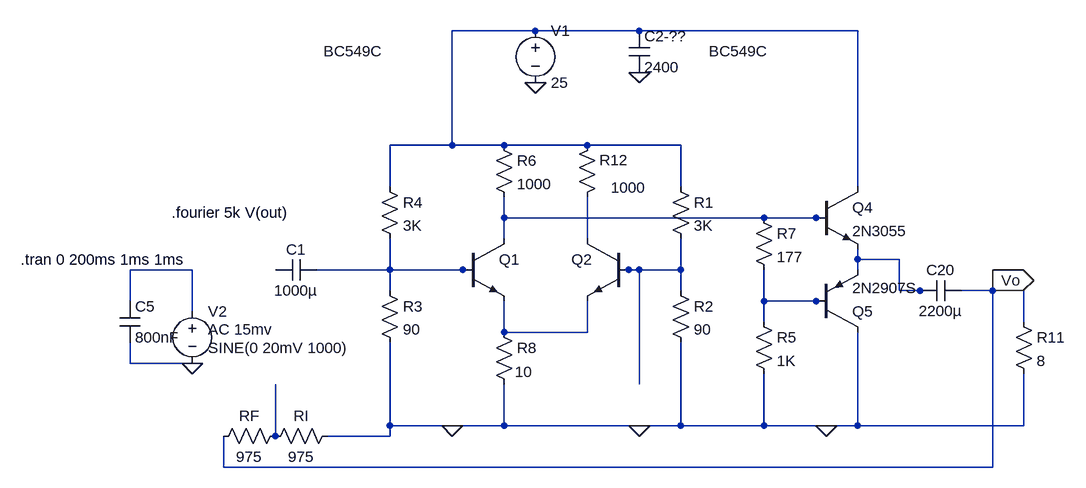
[diagram p0: schematic Trying LTP with Works well  25V  actual values - Push pull without bypass caps without diodes and no Tip122.asc]
Trying LTP with Works well  25V  actual values - Push pull without bypass caps without diodes and no Tip122.asc, the LTspice schematic file:
Version 4
SHEET 1 1788 680
WIRE 272 -256 144 -256
WIRE 432 -256 272 -256
WIRE 768 -256 432 -256
WIRE 144 -80 144 -256
WIRE 144 -80 48 -80
WIRE 224 -80 144 -80
WIRE 352 -80 224 -80
WIRE 496 -80 352 -80
WIRE 48 -16 48 -80
WIRE 496 -16 496 -80
WIRE 768 -16 768 -256
WIRE 224 32 224 0
WIRE 624 32 224 32
WIRE 704 32 624 32
WIRE 720 32 704 32
WIRE 224 64 224 32
WIRE 352 64 352 0
WIRE 768 96 768 80
WIRE 832 96 768 96
WIRE -256 112 -352 112
WIRE -112 112 -128 112
WIRE 48 112 48 64
WIRE 48 112 -64 112
WIRE 160 112 48 112
WIRE 176 112 160 112
WIRE 416 112 400 112
WIRE 432 112 416 112
WIRE 496 112 496 64
WIRE 496 112 432 112
WIRE 768 112 768 96
WIRE 48 144 48 112
WIRE 496 144 496 112
WIRE 832 144 832 96
WIRE 864 144 832 144
WIRE 880 144 864 144
WIRE 976 144 928 144
WIRE 1024 144 976 144
WIRE -352 160 -352 112
WIRE 624 160 624 112
WIRE 704 160 624 160
WIRE 720 160 704 160
WIRE -256 176 -256 112
WIRE 624 192 624 160
WIRE 1024 192 1024 144
WIRE 224 208 224 160
WIRE 352 208 352 160
WIRE 352 208 224 208
WIRE -352 256 -352 224
WIRE -272 256 -352 256
WIRE 432 288 432 112
WIRE 48 352 48 224
WIRE 144 352 48 352
WIRE 224 352 224 288
WIRE 224 352 144 352
WIRE 432 352 224 352
WIRE 496 352 496 224
WIRE 496 352 432 352
WIRE 624 352 624 272
WIRE 624 352 496 352
WIRE 720 352 624 352
WIRE 768 352 768 208
WIRE 768 352 720 352
WIRE 1024 352 1024 272
WIRE 1024 352 768 352
WIRE -128 368 -128 288
WIRE 48 368 48 352
WIRE 48 368 -48 368
WIRE -208 416 -208 368
WIRE 976 416 976 144
WIRE 976 416 -208 416
FLAG 272 -176 0
FLAG 144 352 0
FLAG -256 256 0
FLAG 720 352 0
FLAG 432 -192 0
FLAG 976 128 Vo
IOPIN 976 128 Out
FLAG 432 352 0
SYMBOL npn 160 64 R0
WINDOW 3 -214 -289 Left 2
SYMATTR Value BC549C
SYMATTR InstName Q1
SYMBOL voltage 272 -272 R0
WINDOW 123 0 0 Left 2
WINDOW 39 0 0 Left 2
SYMATTR InstName V1
SYMATTR Value 25
SYMBOL res 32 -32 R0
SYMATTR InstName R4
SYMATTR Value 3K
SYMBOL res 32 128 R0
SYMATTR InstName R3
SYMATTR Value 90
SYMBOL cap -64 96 R90
WINDOW 0 0 32 VBottom 2
WINDOW 3 32 32 VTop 2
SYMATTR InstName C1
SYMATTR Value 1000µ
SYMBOL voltage -256 160 R0
WINDOW 123 24 44 Left 2
WINDOW 39 0 0 Left 2
WINDOW 3 24 72 Left 2
SYMATTR Value2 AC 15mv
SYMATTR Value SINE(0 20mV 1000)
SYMATTR InstName V2
SYMBOL res -112 352 R90
WINDOW 0 0 56 VBottom 2
WINDOW 3 32 56 VTop 2
SYMATTR InstName RF
SYMATTR Value 975
SYMBOL res -32 352 R90
WINDOW 0 0 56 VBottom 2
WINDOW 3 32 56 VTop 2
SYMATTR InstName RI
SYMATTR Value 975
SYMBOL cap -368 160 R0
SYMATTR InstName C5
SYMATTR Value 800nF
SYMBOL npn2 704 -16 R0
SYMATTR InstName Q4
SYMATTR Value 2N3055
SYMBOL res 1008 176 R0
SYMATTR InstName R11
SYMATTR Value 8
SYMBOL pnp 704 208 M180
SYMATTR InstName Q5
SYMATTR Value 2N2907S
SYMBOL cap 928 128 R90
WINDOW 0 0 32 VBottom 2
WINDOW 3 32 32 VTop 2
SYMATTR InstName C20
SYMATTR Value 2200µ
SYMBOL res 608 176 R0
SYMATTR InstName R5
SYMATTR Value 1K
SYMBOL res 608 16 R0
SYMATTR InstName R7
SYMATTR Value 177
SYMBOL cap 416 -256 R0
SYMATTR InstName C2-??
SYMATTR Value 2400
SYMBOL res 208 -96 R0
SYMATTR InstName R6
SYMATTR Value 1000
SYMBOL res 208 192 R0
WINDOW 3 33 77 Left 2
SYMATTR InstName R8
SYMATTR Value 10
SYMBOL npn 416 64 M0
WINDOW 3 -214 -289 Left 2
SYMATTR Value BC549C
SYMATTR InstName Q2
SYMBOL res 368 -96 M0
WINDOW 0 -47 39 Left 2
WINDOW 3 -74 81 Left 2
SYMATTR InstName R12
SYMATTR Value 1000
SYMBOL res 480 -32 R0
SYMATTR InstName R1
SYMATTR Value 3K
SYMBOL res 480 128 R0
SYMATTR InstName R2
SYMATTR Value 90
TEXT -520 96 Left 2 !.tran 0 200ms 1ms 1ms
TEXT -288 24 Left 2 !.fourier 5k V(out)

The netlist it stands for:
* Trying LTP with Works well  25V  actual values - Push pull without bypass caps without diodes and no Tip122.asc
Q1 N002 N007 N011 0 BC549C
V1 N001 0 25
R4 N001 N007 3K
R3 N007 0 90
C1 N007 N006 1000µ
V2 N005 0 SINE(0 20mV 1000) AC 15mv
RF N013 N009 975
RI 0 N013 975
C5 N005 N012 800nF
Q4 N001 N002 N004 0 2N3055
R11 N009 0 8
Q5 0 N010 N004 0 2N2907S
C20 N009 N004 2200µ
R5 N010 0 1K
R7 N002 N010 177
C2-?? N001 0 2400
R6 N001 N002 1000
R8 N011 0 10
Q2 N003 N008 N011 0 BC549C
R12 N001 N003 1000
R1 N001 N008 3K
R2 N008 0 90
.model NPN NPN
.model PNP PNP
.lib standard.bjt
.tran 0 200ms 1ms 1ms
.fourier 5k V(out)
.backanno
.end